# EAGLE design final_board (EAGLE 7.7.0)
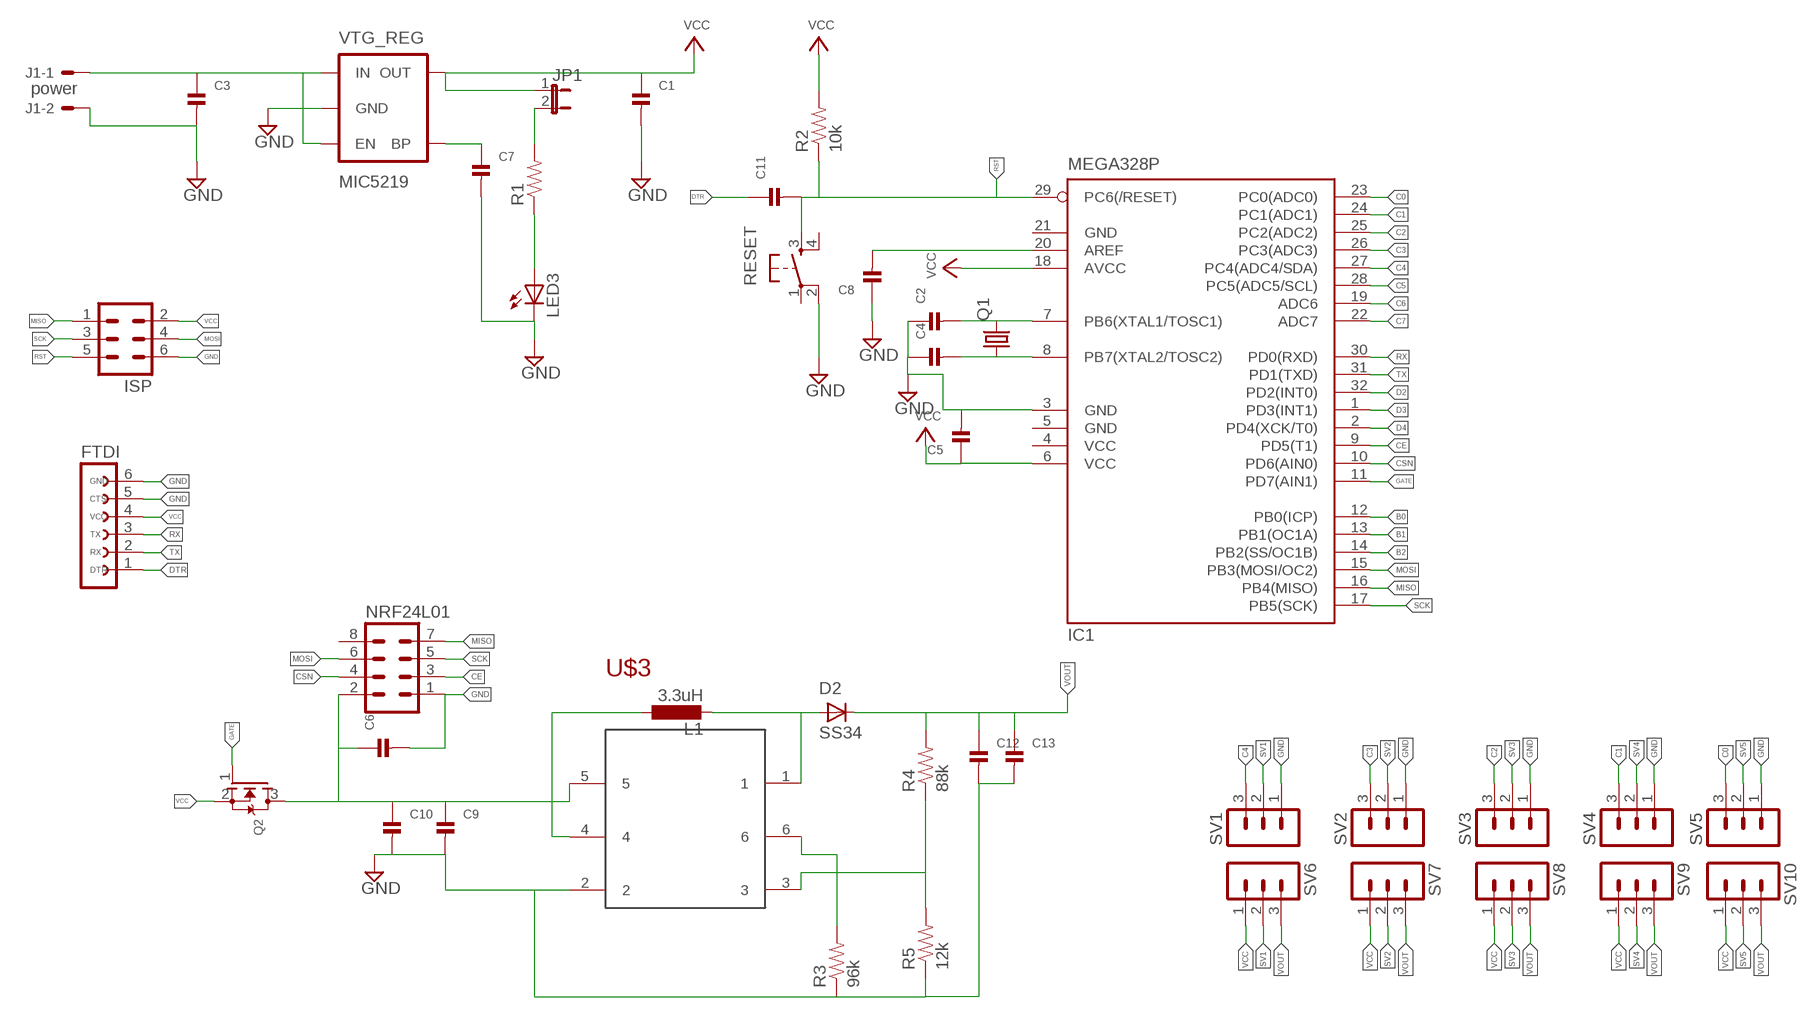
[diagram p0: schematic, sheet 1]

## Parts
C1  CAP_CERAMIC1206  [1206]
C2  CAP_CERAMIC1206  [1206]
C3  CAP_CERAMIC1206  [1206]
C4  CAP_CERAMIC1206  [1206]
C5  CAP_CERAMIC1206  [1206]
C6  CAP_CERAMIC1206  [1206]
C7  CAP_CERAMIC1206  [1206]
C8  CAP_CERAMIC1206  [1206]
C9  CAP_CERAMIC1206  [1206]
C10  CAP_CERAMIC1206  [1206]
C11  CAP_CERAMIC1206  [1206]
C12  CAP_CERAMIC1206  [1206]
C13  CAP_CERAMIC1206  [1206]
D2  SS34  GF1  [SMA-DO214AC]
FTDI  FE06-1  [FE06]
IC1  MEGA328P  MEGA8-AI  [TQFP32-08]
ISP  MA03-2  [MA03-2]
J1  power  22-27-2021-02  [6410-02]
JP1  JP1E  [JP1]
L1  3.3uH  L-EUL4532C  [L4532M]
LED3  LEDSML1206  [SML1206]
NRF24L01  MA04-2  [MA04-2]
Q1  CRYSTALHC49U-V  [HC49U-V]
Q2  MOSFET-NWAVE  [SOT23-W]
R1  RESISTOR1206  [1206]
R2  10k  RESISTOR1206  [1206]
R3  96k  RESISTOR1206  [1206]
R4  88k  RESISTOR1206  [1206]
R5  12k  RESISTOR1206  [1206]
RESET  TAC_SWITCHSMD  [TACTILE_SWITCH_SMD]
SV1  MA03-1  [MA03-1]
SV2  MA03-1  [MA03-1]
SV3  MA03-1  [MA03-1]
SV4  MA03-1  [MA03-1]
SV5  MA03-1  [MA03-1]
SV6  MA03-1  [MA03-1]
SV7  MA03-1  [MA03-1]
SV8  MA03-1  [MA03-1]
SV9  MA03-1  [MA03-1]
SV10  MA03-1  [MA03-1]
U$3  FP6291SOT23-6L  [SOT23-6L]
VTG_REG  MIC5219  V_REG_LDOSMD  [SOT23-5]

## Nets
2: C6.1 C9.1 C10.1 NRF24L01.2 Q2.3(D) U$3.5
5V: C3.1 J1.1 VTG_REG.1(IN) VTG_REG.3(EN)
AREF: C8.2 IC1.20(AREF)
B0: IC1.12(PB0(ICP))
B1: IC1.13(PB1(OC1A))
B2: IC1.14(PB2(SS/OC1B))
C0: IC1.23(PC0(ADC0)) SV5.3
C1: IC1.24(PC1(ADC1)) SV4.3
C2: IC1.25(PC2(ADC2)) SV3.3
C3: IC1.26(PC3(ADC3)) SV2.3
C4: IC1.27(PC4(ADC4/SDA)) SV1.3
C5: IC1.28(PC5(ADC5/SCL))
C6: IC1.19(ADC6)
C7: IC1.22(ADC7)
CE: IC1.9(PD5(T1)) NRF24L01.3
CSN: IC1.10(PD6(AIN0)) NRF24L01.4
D2: IC1.32(PD2(INT0))
D3: IC1.1(PD3(INT1))
D4: IC1.2(PD4(XCK/T0))
DTR: C11.1 FTDI.1
GATE: IC1.11(PD7(AIN1)) Q2.1(G)
GND: C1.2 C2.1 C3.2 C4.1 C5.2 C6.2 C7.2 C8.1 C9.2 C10.2 C12.2 C13.2 FTDI.5 FTDI.6 IC1.3(GND) ISP.6 J1.2 LED3.C NRF24L01.1 R3.1 R5.1 RESET.2 SV1.1 SV2.1 SV3.1 SV4.1 SV5.1 U$3.2 VTG_REG.2(GND)
MISO: IC1.16(PB4(MISO)) ISP.1 NRF24L01.7
MOSI: IC1.15(PB3(MOSI/OC2)) ISP.4 NRF24L01.6
N$1: C2.2 IC1.7(PB6(XTAL1/TOSC1)) Q1.2
N$2: C4.2 IC1.8(PB7(XTAL2/TOSC2)) Q1.1
N$3: JP1.2 R1.2
N$4: LED3.A R1.1
N$14: C7.1 VTG_REG.4(BP)
N$16: L1.1 U$3.4
N$21: R3.2 U$3.6
N$22: D2.A L1.2 U$3.1
N$28: R4.1 R5.2 U$3.3
RST: C11.2 IC1.29(PC6(/RESET)) ISP.5 R2.1 RESET.3
RX: FTDI.3 IC1.30(PD0(RXD))
SCK: IC1.17(PB5(SCK)) ISP.3 NRF24L01.5
SV1: SV1.2 SV6.2
SV2: SV2.2 SV7.2
SV3: SV3.2 SV8.2
SV4: SV4.2 SV9.2
SV5: SV5.2 SV10.2
TX: FTDI.2 IC1.31(PD1(TXD))
VCC: C1.1 C5.1 FTDI.4 IC1.6(VCC) IC1.18(AVCC) ISP.2 JP1.1 Q2.2(S) R2.2 SV6.1 SV7.1 SV8.1 SV9.1 SV10.1 VTG_REG.5(OUT)
VOUT: C12.1 C13.1 D2.K(C) R4.2 SV6.3 SV7.3 SV8.3 SV9.3 SV10.3
Unconnected: NRF24L01.8 RESET.1 RESET.4

## Notes on the sheet
- GND
- CTS
- VCC
- TX
- RX
- DTR

## Power pins joined to a net without a drawn wire
GND: IC1.5(GND) IC1.21(GND)
VCC: IC1.4(VCC)

## Library data of the parts
C1-C13 = microbuilder:CAP_CERAMIC: Ceramic Capacitors 0402 - 0402 Surface Mount Capacitors 16pF 50V 5% [Digikey: 445-4899-2-ND] 18pF 50V 5% [Digikey: 490-1281-2-ND] 22pF 50V 5% [Digikey: 490-1283-2-ND] 68pF 50V 5% [Digikey: 490-1289-2-ND] 0.1uF 10V 10% [Digikey: 490-1318-2-ND] 1.0uF 6.3V 10% [Digikey: 490-1320-2-ND] 0603 - 0603 Surface Mount Capacitors 16 pF 50V 5% [Digikey: 445-5051-2-ND] 22 pF 50V [Digikey: PCC220ACVTR-ND] 33 pF 50V 5% [Digikey: 490-1415-1-ND] 56pF 50V 5% [Digikey: 490-1421-1-ND] 220pF 50V 5% [Digikey: 445-1285-1-ND] 680 pF 50V 2200 pF 50V 5% C0G [Digikey: 445-1297-1-ND] 5600 pF 100V 5% X7R [Digikey: 478-3711-1-ND] 0.1 µF 25V 10% [Digikey: PCC2277TR-ND] 0.22 µF 16V 10% X7R [Digikey: 445-1318-1-ND] 1.0 µF 25V 10% [Digikey: 445-5146-2-ND] 0603 - RF Specific 3pF 250V +/-0.1pF RF [Digikey: 712-1347-1-ND] 18 pF 250V 5% [Digikey: 478-3505-1-ND or 712-1322-1-ND] 56 pF 250V 5% C0G RF [Digikey: 490-4867-1-ND] 68 pF 250V RF [Digikey: 490-4868-1-ND] 0805 - 0805 Surface Mount Capacitors 220 pF 250V 2% RF Ceramic Capacitor [Digikey: 712-1398-1-ND] 1000 pF 50V 2% NP0 Ceramic Capacitor [Digikey: 478-3760-1-ND] 0.1 µF 25V 10% Ceramic Capacitor [Digikey: PCC1828TR-ND] 1.0 µF 16V 10% Ceramic Capacitor[Digikey: 490-1691-2-ND] 10.0 µF 10V 10% Ceramic Capacitor[Digikey: 709-1228-1-ND] 10.0 uF 16V 10% Ceramic Capacitor [Digikey: 478-5165-2-ND] 47 uF 6.3V 20% Ceramic Capacitor [Digikey: 587-1779-1-ND or 399-5506-1-ND] 1206 - 1206 Surface Mount Capacitors 47uF 10V 20% Ceramic Capacitor [Digikey: 490-5528-1-ND or 399-5508-1-ND or 445-6010-1-ND]
D2 = diode:GF1: DIODE
FTDI = con-lsta:FE06-1: FEMALE HEADER; OC_FARNELL: unknown; OC_NEWARK: unknown
IC1 = atmel:MEGA8: MICROCONTROLLER 8 Kbytes FLASH, 1 kbytes SRAM, 512 bytes EEPROM, USART, 6-channel 10 bit ADC, 2-channel 8 bit ADC Pin compatible with Atmega48, ATMega88, ATMega168 Source: avr.lbr; MPN: ATMEGA8-16AU; OC_FARNELL: 9171371; OC_NEWARK: 73M8863
ISP = con-lstb:MA03-2: PIN HEADER; OC_FARNELL: unknown; OC_NEWARK: unknown
J1 = con-molex:22-?-02: CONNECTOR wire to board 2.54 mm (.1 inch) pitch header; OC_FARNELL: unknown; OC_NEWARK: unknown
JP1 = jumper:JP1E: JUMPER
L1 = rcl:L-EU: INDUCTOR, European symbol
LED3 = led:LED: LED OSRAM: - CHIPLED LG R971, LG N971, LY N971, LG Q971, LY Q971, LO R971, LY R971 LH N974, LH R974 LS Q976, LO Q976, LY Q976 LO Q996 - Hyper CHIPLED LW Q18S LB Q993, LB Q99A, LB R99A - SideLED LS A670, LO A670, LY A670, LG A670, LP A670 LB A673, LV A673, LT A673, LW A673 LH A674 LY A675 LS A676, LA A676, LO A676, LY A676, LW A676 LS A679, LY A679, LG A679 - Hyper Micro SIDELED® LS Y876, LA Y876, LO Y876, LY Y876 LT Y87S - SmartLED LW L88C, LW L88S LB L89C, LB L89S, LG L890 LS L89K, LO L89K, LY L89K LS L896, LA L896, LO L896, LY L896 - TOPLED LS T670, LO T670, LY T670, LG T670, LP T670 LSG T670, LSP T670, LSY T670, LOP T670, LYG T670 LG T671, LOG T671, LSG T671 LB T673, LV T673, LT T673, LW T673 LH T674 LS T676, LA T676, LO T676, LY T676, LB T676, LH T676, LSB T676, LW T676 LB T67C, LV T67C, LT T67C, LS T67K, LO T67K, LY T67K, LW E67C LS E67B, LA E67B, LO E67B, LY E67B, LB E67C, LV E67C, LT E67C LW T67C LS T679, LY T679, LG T679 LS T770, LO T770, LY T770, LG T770, LP T770 LB T773, LV T773, LT T773, LW T773 LH T774 LS E675, LA E675, LY E675, LS T675 LS T776, LA T776, LO T776, LY T776, LB T776 LHGB T686 LT T68C, LB T68C - Hyper Mini TOPLED® LB M676 - Mini TOPLED Santana® LG M470 LS M47K, LO M47K, LY M47K Source: http://www.osram.convergy.de LUXEON: - LUMILED® LXK2-PW12-R00, LXK2-PW12-S00, LXK2-PW14-U00, LXK2-PW14-V00 LXK2-PM12-R00, LXK2-PM12-S00, LXK2-PM14-U00 LXK2-PE12-Q00, LXK2-PE12-R00, LXK2-PE12-S00, LXK2-PE14-T00, LXK2-PE14-U00 LXK2-PB12-K00, LXK2-PB12-L00, LXK2-PB12-M00, LXK2-PB14-N00, LXK2-PB14-P00, LXK2-PB14-Q00 LXK2-PR12-L00, LXK2-PR12-M00, LXK2-PR14-Q00, LXK2-PR14-R00 LXK2-PD12-Q00, LXK2-PD12-R00, LXK2-PD12-S00 LXK2-PH12-R00, LXK2-PH12-S00 LXK2-PL12-P00, LXK2-PL12-Q00, LXK2-PL12-R00 Source: www.luxeon.com KINGBRIGHT: KA-3528ASYC Source: www.kingbright.com
NRF24L01 = con-lstb:MA04-2: PIN HEADER; OC_FARNELL: unknown; OC_NEWARK: unknown
Q1 = crystal:CRYSTAL: CRYSTAL; OC_FARNELL: 1666969; OC_NEWARK: unknown
Q2 = microbuilder:MOSFET-N: N-Channel Mosfet 2N7002E - 60V 260mA SOT23 [Digikey: 2N7002ET1GOSTR-ND] BSH103 - 30V 850mA SOT23 [Digikey: 568-5013-1-ND]
R1-R5 = SparkFun:RESISTOR: Resistor Basic schematic elements and footprints for 0603, 1206, and PTH resistors.
RESET = SparkFun:TAC_SWITCH: Momentary Switch Button commonly used for reset or general input. Spark Fun Electronics SKU : COM-00097
SV1-SV10 = con-lstb:MA03-1: PIN HEADER; OC_FARNELL: unknown; OC_NEWARK: unknown
U$3 = fp6291:FP6291: boost FP6291
VTG_REG = SparkFun:V_REG_LDO: Voltage Regulator LDO Standard 150mA LDO voltage regulator in SOT-23 layout. Micrel part MIC5205. BP (by-pass) pin is used to lower output noise with 470pF cap.

## Board
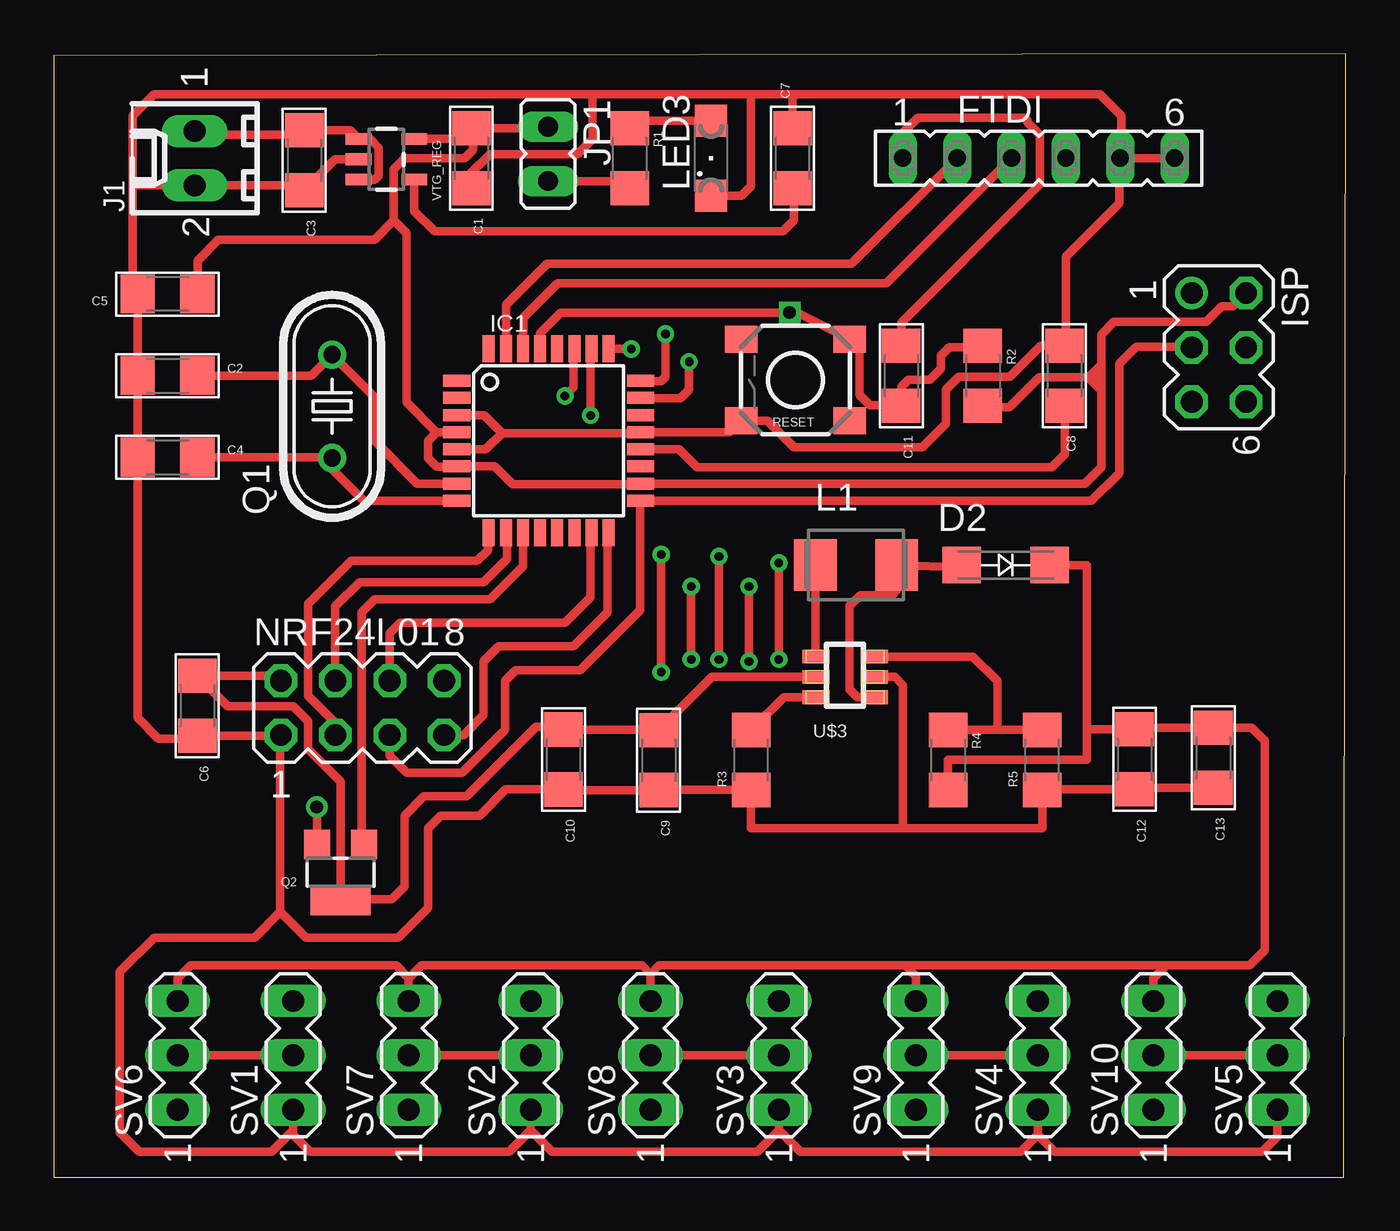
[diagram p1: board, top side]
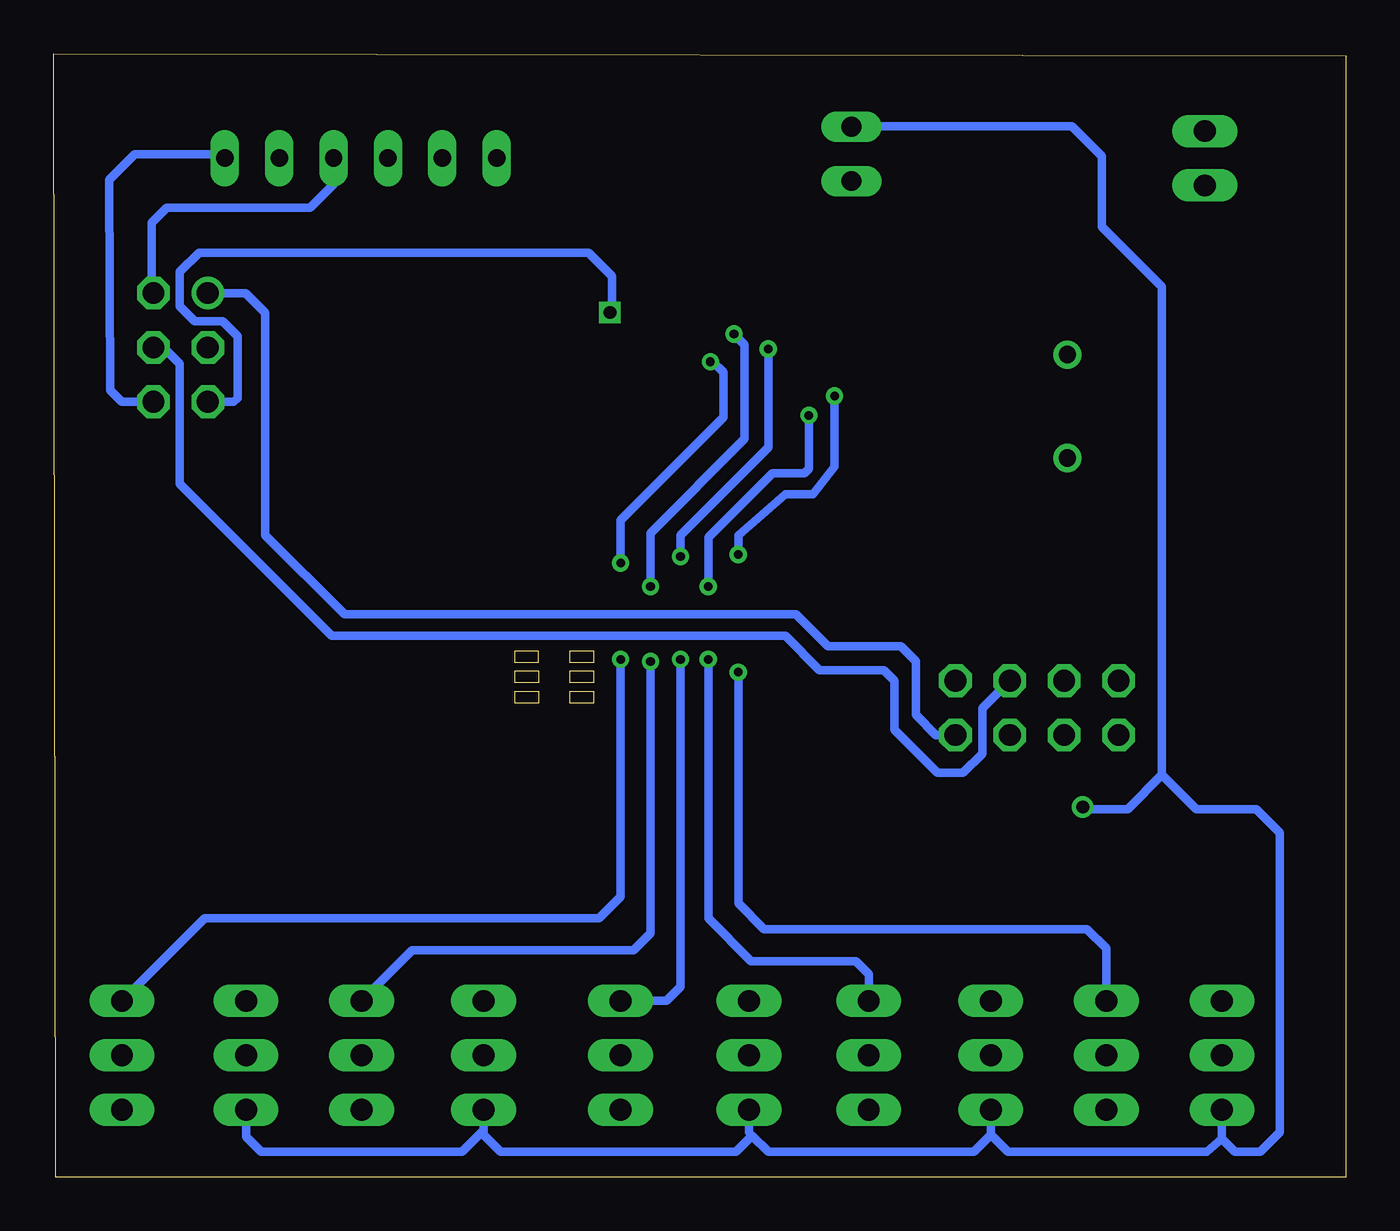
[diagram p2: board, bottom side, seen from below]

Size 60.4 x 52.5 mm. Coordinates in mm from the lower left corner, seen from the top.
Outline: 0,0 60.3,0 60.4,52.5 0,52.4 0,0
Copper layers (1*16): Top 0.035mm / dielectric 1.5mm / Bottom 0.035mm
Design rules "default": minimum track width 10mil, minimum drill 24mil, track to track 8mil, track to pad 8mil, pad to pad 8mil, via to via 8mil, smd to smd 8mil, copper to edge 40mil, drill to drill 8mil, minimum pad ring 10mil, minimum via ring 8mil, stop-mask expansion 4mil, vias tented up to drill 0mil, thermal gap 10mil

### Footprints (pad centres in the part's own frame; a part is rotated, then mirrored left to right if it is on the bottom)
1206 = smd 1.6 x 1.8: 1 -1.4,0; 2 1.4,0
SMA-DO214AC = smd 1.8 x 1.7: A -2.05,0; K 2.05,0
FE06 = drill 0.813 long: 1 -6.35,0; 2 -3.81,0; 3 -1.27,0; 4 1.27,0; 5 3.81,0; 6 6.35,0
TQFP32-08 = smd 1.27 x 0.559: 1 -4.293,2.8; 2 -4.293,2; 3 -4.293,1.2; 4 -4.293,0.4; 5 -4.293,-0.4; 6 -4.293,-1.2; 7 -4.293,-2; 8 -4.293,-2.8; 17 4.293,-2.8; 18 4.293,-2; 19 4.293,-1.2; 20 4.293,-0.4; 21 4.293,0.4; 22 4.293,1.2; 23 4.293,2; 24 4.293,2.8 | smd 0.559 x 1.27: 9 -2.8,-4.293; 10 -2,-4.293; 11 -1.2,-4.293; 12 -0.4,-4.293; 13 0.4,-4.293; 14 1.2,-4.293; 15 2,-4.293; 16 2.8,-4.293; 25 2.8,4.293; 26 2,4.293; 27 1.2,4.293; 28 0.4,4.293; 29 -0.4,4.293; 30 -1.2,4.293; 31 -2,4.293; 32 -2.8,4.293
MA03-2 = drill 1.016: 1 -2.54,-1.27 | drill 1.016 octagon: 2 -2.54,1.27; 3 0,-1.27; 4 0,1.27; 5 2.54,-1.27; 6 2.54,1.27
6410-02 = drill 1.016 long: 1 1.27,0; 2 -1.27,0
JP1 = drill 0.914 long: 1 0,-1.27; 2 0,1.27
L4532M = smd 2 x 2.4: 1 -1.9,0; 2 1.9,0
SML1206 = smd 1.5 x 1.5: A 1.75,0; C -1.75,0
MA04-2 = drill 1.016 octagon: 1 -3.81,-1.27; 2 -3.81,1.27; 3 -1.27,-1.27; 4 -1.27,1.27; 5 1.27,-1.27; 6 1.27,1.27; 7 3.81,-1.27; 8 3.81,1.27
HC49U-V = drill 0.813: 1 -2.413,0; 2 2.413,0
SOT23-W = smd 1.2 x 1.4: 1 -1.1,-1.3; 2 1.1,-1.3 | smd 2.8 x 1.4: 3 0,1.3
TACTILE_SWITCH_SMD = smd 1.524 x 1.27: 1 -2.54,1.905; 2 2.54,1.905; 3 -2.54,-1.905; 4 2.54,-1.905
MA03-1 = drill 1.016 long: 1 -2.54,0; 2 0,0; 3 2.54,0
SOT23-6L = smd 1.27 x 0.635: 1 -1.27,1.27; 2 -1.27,0.32; 3 -1.27,-0.63; 4 1.47,-0.63; 5 1.47,0.32; 6 1.47,1.27
SOT23-5 = smd 0.55 x 1.2: 1 -0.95,-1.3; 2 0,-1.3; 3 0.95,-1.3; 4 0.95,1.3; 5 -0.95,1.3

### Placement (x,y rotation side)
C1  19.53,47.61 270 top
C2  5.33,37.45 0 top
C3  11.72,47.51 270 top
C4  5.33,33.64 0 top
C5  5.33,41.26 180 top
C6  6.72,22.03 270 top
C7  34.54,47.61 90 top
C8  47.24,37.45 270 top
C9  28.28,19.49 270 top
C10  23.83,19.52 270 top
C11  39.62,37.45 270 top
C12  50.52,19.53 270 top
C13  54.2,19.6 270 top
D2  44.5,28.6 0 top
FTDI  46.04,47.61 0 top
IC1  23.14,34.41 0 top
ISP  54.46,38.77 270 top
J1  6.6,47.61 90 top
JP1  23.11,47.81 180 top
L1  37.5,28.6 0 top
LED3  30.73,47.61 90 top
NRF24L01  14.44,21.93 0 top
Q1  13.02,36.02 90 top
Q2  13.42,14.25 180 top
R1  26.92,47.61 270 top
R2  43.43,37.45 270 top
R3  32.6,19.5 90 top
R4  41.8,19.5 270 top
R5  46.2,19.5 90 top
RESET  34.67,37.25 180 top
SV1  11.2,5.7 90 top
SV2  22.3,5.7 90 top
SV3  33.9,5.7 90 top
SV4  46,5.7 90 top
SV5  57.2,5.7 90 top
SV6  5.8,5.7 90 top
SV7  16.6,5.7 90 top
SV8  27.9,5.7 90 top
SV9  40.3,5.7 90 top
SV10  51.4,5.7 90 top
U$3  37.1,23.7 180 top
VTG_REG  15.56,47.56 270 top

### Tracks (layer width: path | path; a pad name or v marks a point on that pad's centre or on a via)
2
  Top 0.406: U$3.5 30.77,23.38 C9.1 28.25,20.92 C10.1 23.7,21.05 22.55,21.05 19.3,17.8 17.3,17.8 16.4,16.9 16.4,13.6 15.8,13 13.47,13 Q2.3 13.42,18.48 11.9,20 11.9,21.3 11.2,22 8.15,22 C6.1 10.4,23.43 NRF24L01.2
5V
  Top 0.406: J1.1 6.62,48.88 6.8,48.7 11.51,48.7 C3.1 13.86,48.91 VTG_REG.1 14.79,48.51 15.2,48.1 15.2,46.8 15,46.6 VTG_REG.3
AREF
  Top 0.406: 47.24,36.07 C8.2 47.26,36.03 47.26,33.77 46.66,33.17 30.06,33.17 29.22,34.01 IC1.20
C0  (via drill 0.4 pad 0.25)
  Top 0.406: v33.9,24.2 v33.9,28.7 | v29.7,38.1 29.7,36.8 29.3,36.4 27.44,36.4 IC1.23
  Bottom 0.406: SV5.3 53.34,12.1 34.9,12.1 33.9,13.1 v33.9,24.2 | v33.9,28.7 33.9,30.7 29.1,35.5 29.1,37.6 29.6,38.1 v29.7,38.1
C1  (via drill 0.4 pad 0.25)
  Top 0.406: v32.5,24.1 v32.5,27.6 | v28.6,39.4 28.6,37.4 28.4,37.2 27.44,37.2 IC1.24
  Bottom 0.406: SV4.3 43.64,10.6 33.3,10.6 32.5,11.4 v32.5,24.1 | v32.5,27.6 32.5,30.1 28.1,34.5 28.1,38.9 v28.6,39.4
C2  (via drill 0.4 pad 0.25)
  Top 0.406: v31.1,24.2 v31.1,29 | v27,38.7 IC1.25
  Bottom 0.406: SV3.3 31.76,8.24 31.1,8.9 v31.1,24.2 | v31.1,29 31.1,30 27,34.1 v27,38.7
C3  (via drill 0.4 pad 0.25)
  Top 0.406: v29.8,24.2 v29.8,27.6 | v25.1,35.6 25.1,38.66 IC1.26
  Bottom 0.406: SV2.3 22.3,9.5 22.9,10.1 27.8,10.1 29.8,12.1 v29.8,24.2 | v29.8,27.6 29.8,29.9 26.8,32.9 25.3,32.9 25.1,33.1 v25.1,35.6
C4  (via drill 0.4 pad 0.25)
  Top 0.406: v28.4,23.6 v28.4,29.1 | IC1.27 24.3,38.66 24.3,36.9 v23.9,36.5
  Bottom 0.406: SV1.3 11.2,10.7 12.1,11.6 27.2,11.6 28.4,12.8 v28.4,23.6 | v28.4,29.1 28.4,30 26.2,31.9 24.9,31.9 23.9,33.2 v23.9,36.5
CE
  Top 0.406: NRF24L01.3 13.17,21.23 11.9,22.5 11.9,26.8 13.9,28.8 19.8,28.8 20.3,29.3 20.3,30.08 IC1.9
CSN
  Top 0.406: NRF24L01.4 13.17,26.67 14.3,27.8 20.1,27.8 21.2,28.9 21.2,30.06 IC1.10
DTR
  Top 0.406: C11.1 39.62,39.92 46.1,46.4 46.1,48.7 45.5,49.3 45.5,49.4 45.4,49.5 40.4,49.5 39.7,48.8 FTDI.1
GATE
  Top 0.406: IC1.11 21.94,28.54 20.4,27 15,27 14.4,26.4 14.4,15.67 Q2.1
GND
  Top 0.406: FTDI.5 FTDI.6 | C13.2 50.52,18.2 C12.2 46.2,18.13 R5.1 46.2,16.3 39.7,16.3 | 39.7,16.3 32.6,16.3 R3.1 C9.2 23.83,18.09 C10.2 21.12,18.12 19.9,16.9 18.1,16.9 17.5,16.3 17.5,12.6 16.1,11.2 11.8,11.2 10.6,12.4 | 20.96,34.77 20.12,35.61 IC1.3 | 20.96,34.77 27.39,34.77 IC1.21 31.59,34.81 RESET.2 33.35,35.34 34.6,34.1 40.6,34.1 41.7,35.2 41.7,36.8 42.3,37.4 44.7,37.4 46.15,38.85 C8.1 47.31,38.85 47.31,43.01 49.8,45.5 49.8,47.56 FTDI.5 | VTG_REG.2 13.17,47.56 C3.2 11.49,46.34 J1.2 3.7,46.34 | 25.3,50.6 4.7,50.6 3.7,49.6 3.7,46.34 | 25.3,50.6 32.6,50.6 | 32.6,50.6 34.7,50.6 | 34.7,50.6 48.9,50.6 49.9,49.6 49.9,47.66 FTDI.5 | C7.2 34.54,50.44 34.7,50.6 | LED3.C 32.16,45.86 32.6,46.3 32.6,50.6 | 3.7,46.34 3.7,41.65 3.93,41.42 C5.2 C2.1 C4.1 3.93,21.47 4.9,20.5 6.59,20.5 C6.2 10.6,20.63 | C1.2 19.5,46.24 19.5,46.9 20.4,47.8 24.5,47.8 25.2,48.5 25.2,50.5 25.3,50.6 | U$3.2 39.32,23.38 39.7,23 39.7,16.3 | 10.6,12.4 10.6,20.63 | 10.6,20.63 NRF24L01.1 | SV4.1 46,2 | 46,2 46.8,1.2 56.5,1.2 57.2,1.9 SV5.1 | SV3.1 33.9,2.2 | 33.9,2.2 34.9,1.2 45.2,1.2 46,2 | SV2.1 22.3,2.2 | 22.3,2.2 23.3,1.2 32.9,1.2 33.9,2.2 | 22.3,2.2 21.3,1.2 12,1.2 11.2,2 SV1.1 11.2,2.2 10.2,1.2 4,1.2 3.1,2.1 3.1,9.6 4.7,11.2 9.4,11.2 10.6,12.4 | IC1.5 20.2,34.01 20.96,34.77
  Bottom 0.406: ISP.6 57.22,36.23 57.76,36.77 57.8,46.6 56.6,47.8 52.58,47.8 FTDI.6
GND5
  Top 0.406: 49.9,48 50.3,47.6 49.9,47.2
MISO
  Top 0.406: NRF24L01.7 19.16,20.66 20.1,21.6 20.1,24.1 20.8,24.8 24.3,24.8 25.9,26.4 25.9,30.08 IC1.16
  Bottom 0.406: ISP.1 51.41,41.31 50.5,40.4 50.5,30 46.8,26.3 25.7,26.3 24.2,24.8 20.8,24.8 20.1,24.1 20.1,21.6 19.16,20.66 NRF24L01.7
MOSI
  Top 0.406: NRF24L01.6 15.71,25.41 16.2,25.9 23.9,25.9 25.1,27.1 25.1,30.08 IC1.15
  Bottom 0.406: ISP.4 55.27,38.77 54.5,38 54.5,32.4 47.4,25.3 26.2,25.3 24.6,23.7 21.6,23.7 21.1,23.2 21.1,20.9 19.1,18.9 17.9,18.9 17,19.8 17,21.91 NRF24L01.6
N$1
  Top 0.406: C2.2 12.04,37.45 Q1.2 15,36.45 15,34.4 16.99,32.41 IC1.7
N$2
  Top 0.406: C4.2 12.99,33.64 Q1.1 13.02,33.08 14.5,31.6 18.84,31.6 IC1.8
N$3
  Top 0.406: JP1.2 26.59,46.54 R1.2
N$4
  Top 0.406: R1.1 26.92,49.36 LED3.A
N$14
  Top 0.406: VTG_REG.4 16.86,45.14 17.8,44.2 34.1,44.2 34.6,44.7 34.6,46.15 C7.1
N$15
  Top 0.406: 48.4,37.4 48.9,37.9
N$16
  Top 0.406: L1.1 35.6,25 U$3.4
N$21
  Top 0.406: U$3.6 34.13,22.43 R3.2
N$22
  Top 0.406: D2.A 42.45,28.5 L1.2 39.4,27.4 39.2,27.2 37.7,27.2 37.2,26.7 37.2,22.8 37.57,22.43 U$3.1
N$28
  Top 0.406: R4.1 44,20.9 | 44,20.9 R5.2 | U$3.3 42.97,24.33 44.1,23.2 44.1,21 44,20.9
RST  (via drill 0.6)
  Top 0.406: R2.1 43.35,38.77 41.86,38.77 41.46,38.37 41.46,37.77 40.96,37.27 39.96,37.27 39.62,36.93 C11.2 39.6,36.07 38.16,36.07 37.66,36.57 37.66,38.77 37.07,39.35 RESET.3 34.77,40.4 v34.4,40.4 23.7,40.4 22.74,39.44 IC1.29
  Bottom 0.406: ISP.5 51.97,36.23 51.8,36.4 51.8,39.3 52.5,40 53.8,40 54.5,40.7 54.5,42.3 53.6,43.2 35.4,43.2 34.3,42.1 34.3,40.5 v34.4,40.4
RX
  Top 0.406: FTDI.3 44.8,47.61 | IC1.30 21.96,40.17 23.56,41.77 38.93,41.77 FTDI.3 | 44.8,47.58 FTDI.3
SCK
  Top 0.406: NRF24L01.5 15.71,19.69 16.5,18.9 19.1,18.9 21.1,20.9 21.1,23.2 21.6,23.7 24.6,23.7 27.4,26.5 27.4,31.58 IC1.17 48.51,31.61 49.8,32.9 49.8,38 50.6,38.8 53.16,38.8 ISP.3
SV1
  Top 0.406: SV6.2 SV1.2
SV2
  Top 0.406: SV7.2 SV2.2
SV3
  Top 0.406: SV8.2 SV3.2
SV4
  Top 0.406: SV9.2 SV4.2
SV5
  Top 0.406: SV10.2 SV5.2
TX
  Top 0.406: IC1.31 21.16,40.47 21.16,40.77 23.06,42.67 37.29,42.67 FTDI.2 42.2,47.58
VCC  (via drill 0.6)
  Top 0.406: VTG_REG.5 19.03,48.51 C1.1 | C1.1 23.04,49.01 JP1.1 | C5.1 6.73,42.83 7.7,43.8 15,43.8 15.9,44.7 | 15.9,44.7 15.9,47.1 16.4,47.6 19.2,47.6 19.6,48 19.6,48.94 C1.1 | 48.96,36.77 48.96,33.17 48.2,32.41 IC1.18 27.39,32.37 21.46,32.37 20.62,33.21 IC1.6 18.84,33.2 17.9,33.2 17.5,33.6 17.5,34.4 17.91,34.81 | 48.96,36.77 48.36,37.37 46.06,37.37 44.66,35.97 43.51,35.97 R2.2 | 48.96,36.77 48.96,37.37 | 48.96,37.37 48.96,39.37 49.56,39.97 53.87,39.97 54.6,40.7 55.12,40.7 ISP.2 | 48.46,37.37 48.96,37.37 | IC1.4 17.91,34.81 | Q2.2 12.32,17.28 v12.3,17.3 | 15.9,44.7 16.5,44.1 16.5,36.2 17.89,34.81 17.91,34.81
  Bottom 0.406: FTDI.4 47.31,46.39 48.4,45.3 55.1,45.3 55.8,44.6 55.8,41.38 ISP.2 | v12.3,17.3 12.3,17.2 10.2,17.2 8.6,18.8 | 8.6,18.8 8.6,41.6 11.4,44.4 11.4,47.7 12.8,49.1 23.09,49.1 JP1.1 | 16.6,2 SV7.1 | SV8.1 27.9,2.1 27.75,1.95 | 27.75,1.95 27,1.2 17.4,1.2 16.6,2 | SV9.1 40.3,2.2 | 40.3,2.2 40.3,2 39.5,1.2 28.5,1.2 27.75,1.95 | SV10.1 51.4,1.9 50.7,1.2 41.3,1.2 40.3,2.2 | 5.8,1.8 5.2,1.2 4,1.2 3.1,2.1 3.1,16.1 4.2,17.2 7,17.2 8.6,18.8 | SV6.1 5.8,1.8 | 5.8,1.8 6.5,1.2 15.8,1.2 16.6,2
VOUT
  Top 0.406: R4.2 41.8,19.5 48.3,19.5 48.3,20.93 | 48.3,20.93 C12.1 50.52,21 C13.1 56,21 56.6,20.4 56.6,10.6 55.9,9.9 52.4,9.9 52,9.9 | D2.K 48.3,28.6 48.3,20.93 | SV6.3 5.8,9.3 6.4,9.9 16,9.9 16.6,9.3 | 16.6,9.3 SV7.3 | SV8.3 27.9,9.5 | 27.9,9.5 27.5,9.9 17.2,9.9 16.6,9.3 | SV9.3 40.3,9.4 39.8,9.9 | 39.8,9.9 28.3,9.9 27.9,9.5 | SV10.3 51.4,9.3 52,9.9 | 39.8,9.9 52,9.9